# EAGLE design Digital Pressure Sensor (EAGLE 7.2.0)
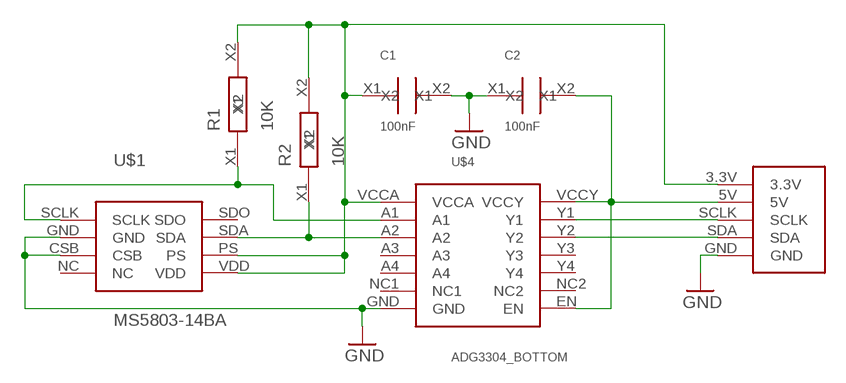
[diagram p0: schematic, sheet 1]

## Parts
C1  100nF  C_SMD_2.1X1.25_BOTTOM  [SMD_2.1X1.25_BOTTOM]
C2  100nF  C_SMD_2.1X1.25_BOTTOM  [SMD_2.1X1.25_BOTTOM]
R1  10K  R_SMD_2.1X1.25_BOTTOM  [SMD_2.1X1.25_BOTTOM]
R2  10K  R_SMD_2.1X1.25_BOTTOM  [SMD_2.1X1.25_BOTTOM]
U$1  MS5803-14BA  [MS5803-14BA]
U$3  5-PIN-PLUG  [5-PIN-PLUG]
U$4  ADG3304_BOTTOM  [ADG3304_BOTTOM]

## Nets
GND: C1.X2 C2.X1 U$1.CSB U$1.GND U$3.GND U$4.GND
N$1: R2.X1 U$1.SDA U$4.A2
N$2: R1.X1 U$1.SCLK U$4.A1
N$3: U$3.SCLK U$4.Y1
N$4: C1.X1 R1.X2 R2.X2 U$1.PS U$1.VDD U$3.3.3V U$4.VCCA
N$5: C2.X2 U$3.5V U$4.EN U$4.VCCY
N$6: U$3.SDA U$4.Y2
Unconnected: U$1.NC U$1.SDO U$4.A3 U$4.A4 U$4.NC1 U$4.NC2 U$4.Y3 U$4.Y4

## Library data of the parts
C1 C2 = MyPowerComponents:C_SMD_2.1X1.25_BOTTOM
R1 R2 = MyPowerComponents:R_SMD_2.1X1.25_BOTTOM
U$1 = MyAmSys:MS5803-14BA
U$3 = MyAmSys:5-PIN-PLUG
U$4 = MyAmSys:ADG3304_BOTTOM

## Board
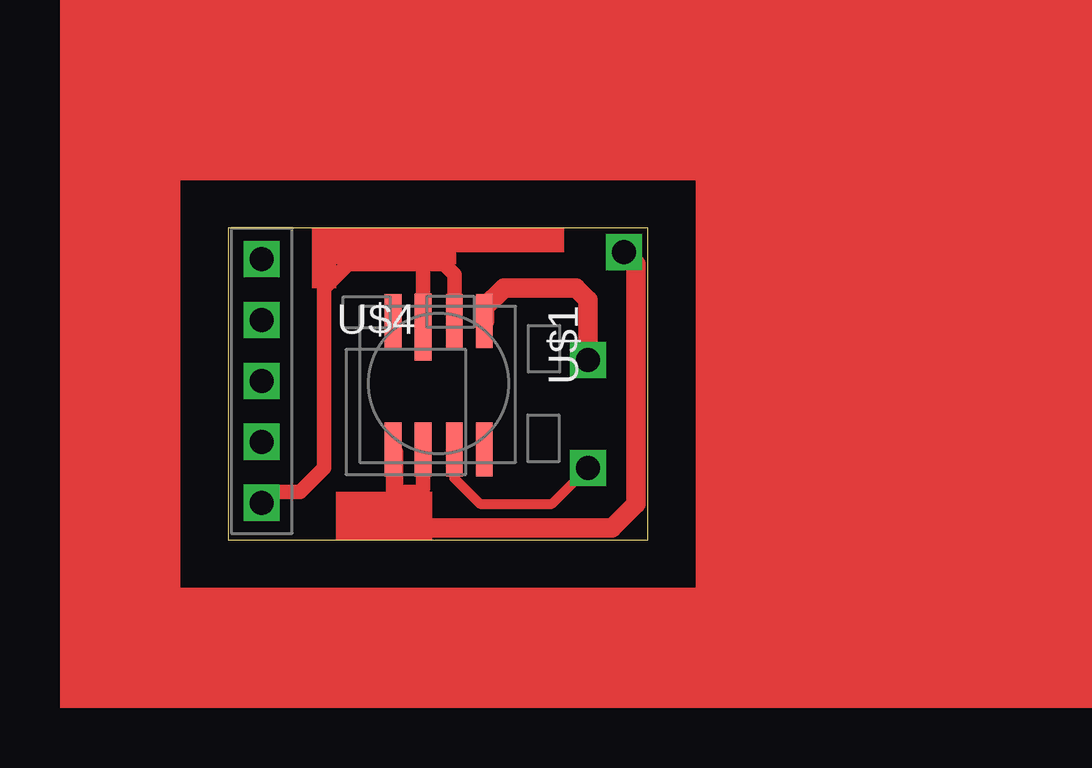
[diagram p1: board, top side]
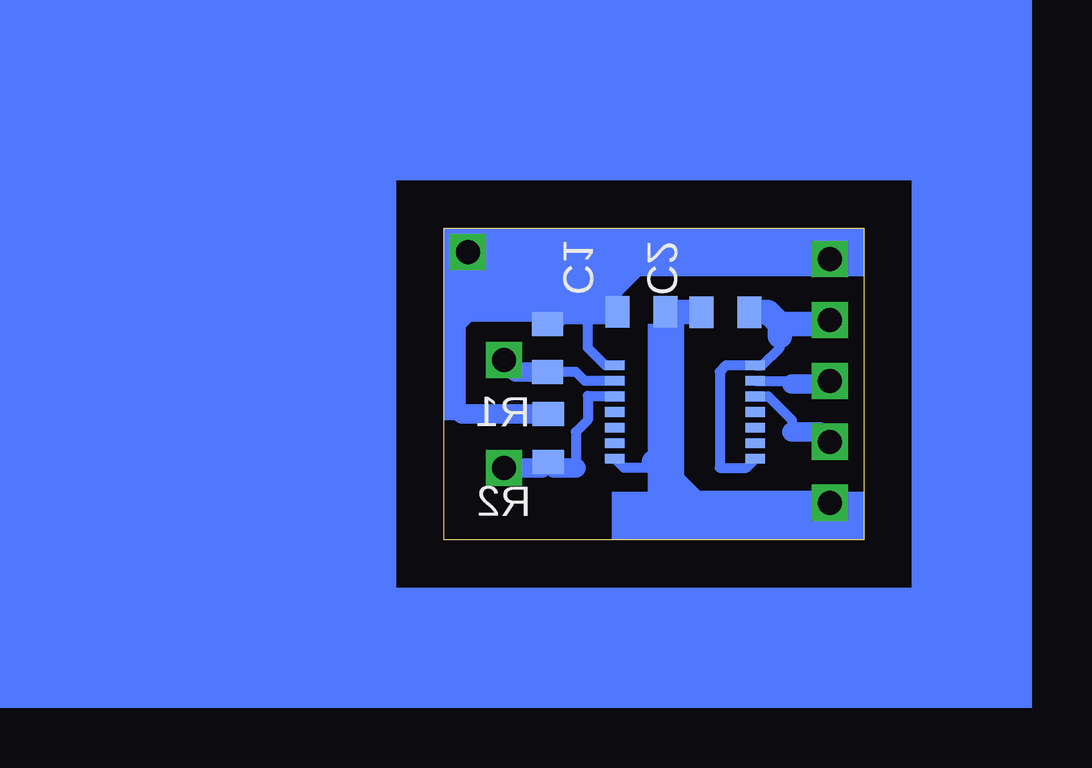
[diagram p2: board, bottom side, seen from below]

Size 17.5 x 13 mm. Coordinates in mm from the lower left corner, seen from the top.
Outline: 0,0 17.5,0 17.5,13 0,13 0,0
Copper layers (1*16): Top 0.035mm / dielectric 1.5mm / Bottom 0.035mm
Design rules "default": minimum track width 10mil, minimum drill 24mil, track to track 8mil, track to pad 8mil, pad to pad 8mil, via to via 8mil, smd to smd 8mil, copper to edge 40mil, drill to drill 8mil, minimum pad ring 10mil, minimum via ring 8mil, stop-mask expansion 4mil, vias tented up to drill 0mil, thermal gap 10mil

### Footprints (pad centres in the part's own frame; a part is rotated, then mirrored left to right if it is on the bottom)
SMD_2.1X1.25_BOTTOM = smd 1.3 x 1 bottom: X1 0,1; X2 0,-1
MS5803-14BA = smd 2.8 x 0.7: CSB 0.25,-1.3 | smd 2.25 x 0.7: GND 0,0; NC 0,-2.55; PS 5.35,-1.3; SCLK 0,1.25; SDA 5.35,0; SDO 5.35,1.25; VDD 5.35,-2.55
5-PIN-PLUG = drill 1 square: 3.3V 0,5.08; 5V 0,2.54; GND 0,-5.08; SCLK 0,0; SDA 0,-2.54
ADG3304_BOTTOM = smd 0.813 x 0.406 bottom: A1 5.85,1.3; A2 5.85,0.65; A3 5.85,0; A4 5.85,-0.65; EN 0,-1.95; GND 5.85,-1.95; NC1 5.85,-1.3; NC2 0,-1.3; VCCA 5.85,1.95; VCCY 0,1.95; Y1 0,1.3; Y2 0,0.65; Y3 0,0; Y4 0,-0.65

### Placement (x,y rotation side)
C1  9.26,9.5 270 top
C2  5.76,9.48 270 top
R1  13.18,7.98 180 top
R2  13.15,4.25 180 top
U$1  9.44,9.12 270 top
U$3  1.41,6.62 0 top
U$4  4.52,5.32 0 top

### Tracks (layer width: path | path; a pad name or v marks a point on that pad's centre or on a via)
GND
  Top 0.61: U$1.CSB 8.14,11.36 | 8.14,11.36 8,11.5 5,11.5 4,10.5 4,3 3,2 1.87,2 U$3.GND | U$1.GND 9.44,11.06 9,11.5 8.28,11.5 8.14,11.36
  Bottom 0.406: C1.X2 8.26,3.74 8.75,3.25 9,3 10,3 U$4.GND
  Bottom 1.016: C1.X2 6.78,9.5 C2.X1 | U$3.GND 7.04,1.54 8.75,3.25
N$1  (via drill 1)
  Top 0.406: U$1.SDA 9.44,2.56 10.5,1.5 13.5,1.5 v15,3
  Bottom 0.406: U$4.A2 11.47,5.97 11.5,6 11.5,5 12,4.5 12,3
  Bottom 0.813: 12,3 12.9,3 R2.X1 13.4,3 v15,3
N$2  (via drill 1)
  Top 0.813: U$1.SCLK 10.69,9.69 11.5,10.5 14.5,10.5 15,10 v15,7.5
  Bottom 0.406: U$4.A1 11.62,6.62 12,7 13.16,7 R1.X1
  Bottom 0.813: v15,7.5 14.5,7 13.2,7 R1.X1
N$3
  Bottom 0.406: U$4.Y1 3.12,6.62 3,6.5
  Bottom 0.813: 3,6.5 1.53,6.5 U$3.SCLK
N$4  (via drill 1)
  Top 0.61: U$1.PS 8.14,2.14 8,2 7,2 7,3.66 U$1.VDD 6.89,1.61 8,0.5
  Top 0.813: 8,0.5 16,0.5 17,1.5 17,11.5 v16.5,12
  Bottom 0.406: R2.X2 13.25,5.25 13.5,5.5 | U$4.VCCA 10.77,7.27 11.5,8 11.5,9.5
  Bottom 0.813: R2.X2 16.75,5.25 17,5.5 17,9 16.5,9.5 16,9.5 | 16,9.5 13,9.5 12.83,9.33 | v16.5,12 16.5,10 16,9.5
  Bottom 1.016: 11.5,9.5 C1.X1 | 11.5,9.5 12.66,9.5 12.83,9.33 R1.X2 | U$3.3.3V 9.3,11.7 11.5,9.5
N$5
  Bottom 0.406: U$4.EN 4.89,3 6,3 6,7 5.73,7.27 U$4.VCCY 4.23,7.27 3.5,8 3.5,8.5
  Bottom 1.016: 3.5,8.5 3.5,9 | 3.5,9 1.57,9 U$3.5V | C2.X2 3.98,9.48 3.5,9
N$6
  Bottom 0.406: U$4.Y2 3.97,5.97 3,5 3,4.5
  Bottom 0.813: 3,4.5 1.83,4.5 U$3.SDA
N$7  (via drill 1)
  other vias: 15,7.5
N$8  (via drill 1)
  other vias: 15,3
N$9  (via drill 1)
  other vias: 16.5,12
(copper drawn outside any net)
  shapes: Bottom area x13, Top area x14